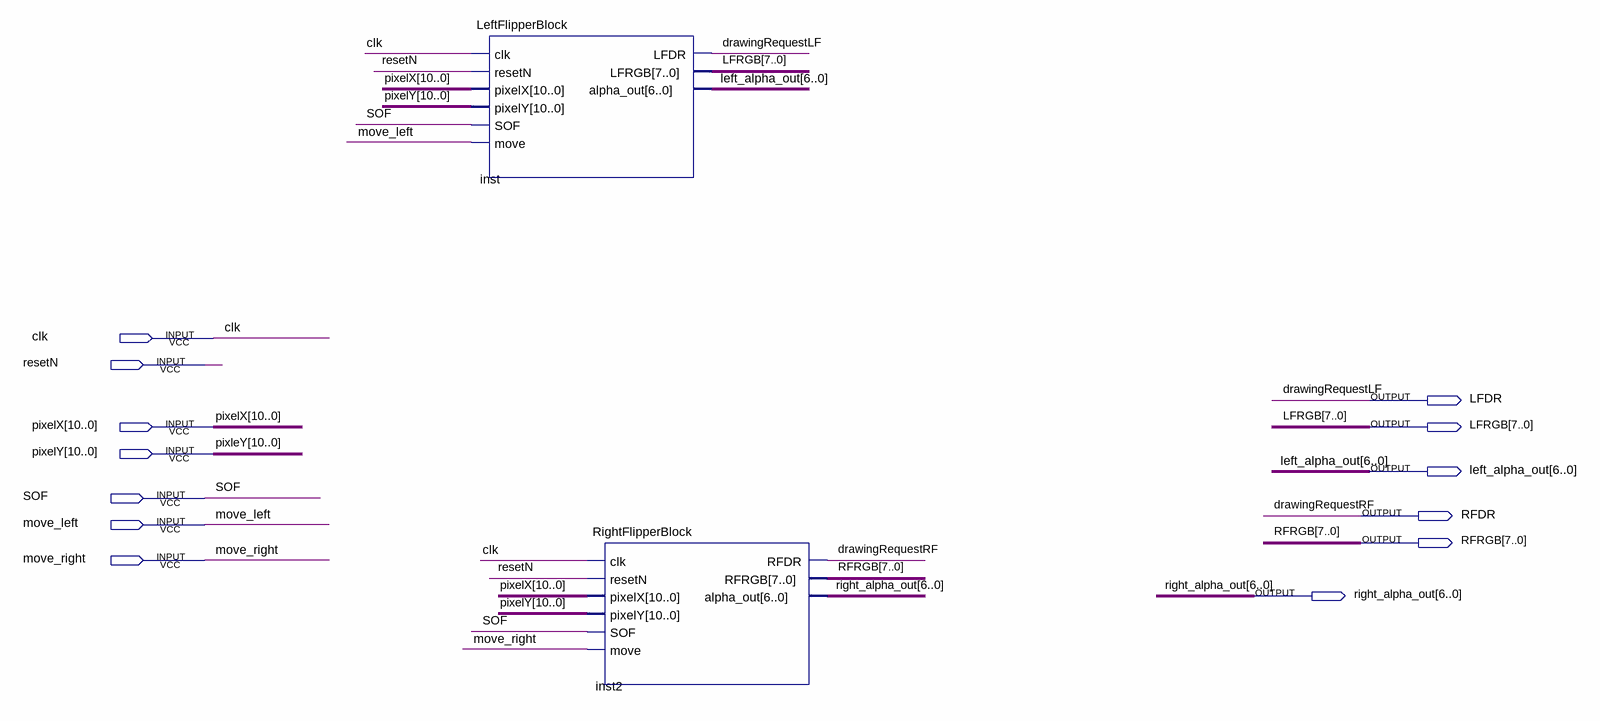
[diagram p0: schematic sheet]
// Quartus schematic flippersBlock.bdf as structural Verilog: 2 symbols, 13 pins
module flippersBlock (
  input  clk,
  input  resetN,
  input  [10:0] pixelX,
  input  [10:0] pixelY,
  input  SOF,
  input  move_left,
  input  move_right,
  output LFDR,
  output [7:0] LFRGB,
  output [6:0] left_alpha_out,
  output RFDR,
  output [7:0] RFRGB,
  output [6:0] right_alpha_out
);

  LeftFlipperBlock inst (
    .clk(clk), .resetN(resetN), .pixelX(pixelX), .pixelY(pixelY), .SOF(SOF), .move(move_left), .LFDR(LFDR),
    .LFRGB(LFRGB), .alpha_out(left_alpha_out));
  RightFlipperBlock inst2 (
    .clk(clk), .resetN(resetN), .pixelX(pixelX), .pixelY(pixelY), .SOF(SOF), .move(move_right), .RFDR(RFDR),
    .RFRGB(RFRGB), .alpha_out(right_alpha_out));

  // Other names for the same wires on the sheet: drawingRequestLF = LFDR; drawingRequestRF = RFDR;
  //   pixleY[10:0] = pixelY
endmodule
